# EAGLE schematic pcb (EAGLE 8.1.0)
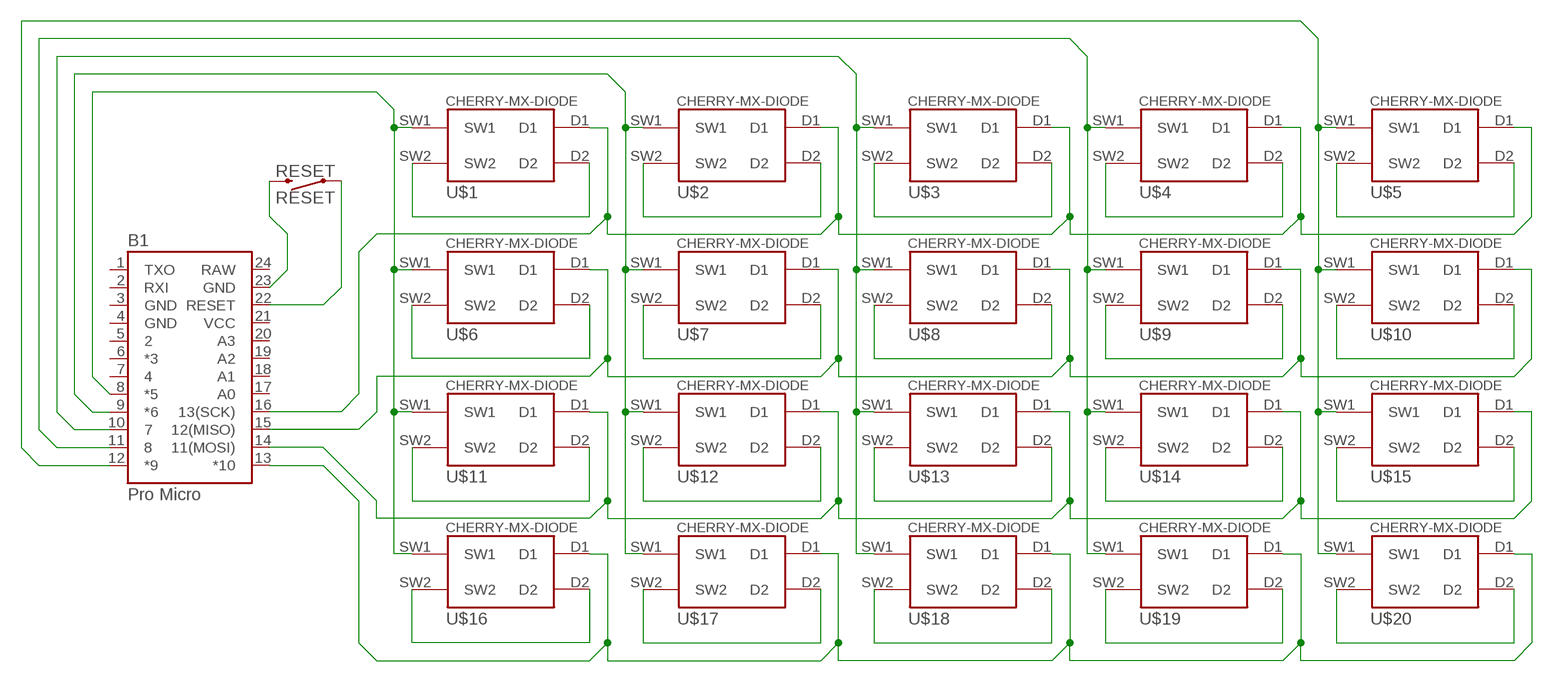
[diagram p0: schematic, sheet 1]

## Parts
B1  Pro Micro  SPARKFUN_PRO_MICRO  [SPARKFUN_PRO_MICRO]
RESET  RESET  MOMENTARY-SWITCH-SPST-PTH-12MM  [TACTILE_SWITCH_PTH_12MM]
U$1  CHERRY-MX-DIODE  [CHERRY-MX-DIODE]
U$2  CHERRY-MX-DIODE  [CHERRY-MX-DIODE]
U$3  CHERRY-MX-DIODE  [CHERRY-MX-DIODE]
U$4  CHERRY-MX-DIODE  [CHERRY-MX-DIODE]
U$5  CHERRY-MX-DIODE  [CHERRY-MX-DIODE]
U$6  CHERRY-MX-DIODE  [CHERRY-MX-DIODE]
U$7  CHERRY-MX-DIODE  [CHERRY-MX-DIODE]
U$8  CHERRY-MX-DIODE  [CHERRY-MX-DIODE]
U$9  CHERRY-MX-DIODE  [CHERRY-MX-DIODE]
U$10  CHERRY-MX-DIODE  [CHERRY-MX-DIODE]
U$11  CHERRY-MX-DIODE  [CHERRY-MX-DIODE]
U$12  CHERRY-MX-DIODE  [CHERRY-MX-DIODE]
U$13  CHERRY-MX-DIODE  [CHERRY-MX-DIODE]
U$14  CHERRY-MX-DIODE  [CHERRY-MX-DIODE]
U$15  CHERRY-MX-DIODE  [CHERRY-MX-DIODE]
U$16  CHERRY-MX-DIODE  [CHERRY-MX-DIODE]
U$17  CHERRY-MX-DIODE  [CHERRY-MX-DIODE]
U$18  CHERRY-MX-DIODE  [CHERRY-MX-DIODE]
U$19  CHERRY-MX-DIODE  [CHERRY-MX-DIODE]
U$20  CHERRY-MX-DIODE  [CHERRY-MX-DIODE]

## Nets
N$1: B1.8(*5) U$1.SW1 U$6.SW1 U$11.SW1 U$16.SW1
N$2: B1.9(*6) U$2.SW1 U$7.SW1 U$12.SW1 U$17.SW1
N$3: B1.23(GND) RESET.3
N$4: B1.11 U$4.SW1 U$9.SW1 U$14.SW1 U$19.SW1
N$5: B1.12(*9) U$5.SW1 U$10.SW1 U$15.SW1 U$20.SW1
N$6: U$2.D2 U$2.SW2
N$7: U$7.D2 U$7.SW2
N$8: U$12.D2 U$12.SW2
N$9: U$17.D2 U$17.SW2
N$10: U$1.D2 U$1.SW2
N$11: U$6.D2 U$6.SW2
N$12: U$11.D2 U$11.SW2
N$13: U$16.D2 U$16.SW2
N$14: U$3.D2 U$3.SW2
N$15: U$8.D2 U$8.SW2
N$16: U$13.D2 U$13.SW2
N$17: U$18.D2 U$18.SW2
N$18: U$4.D2 U$4.SW2
N$19: U$9.D2 U$9.SW2
N$20: U$14.D2 U$14.SW2
N$21: U$19.D2 U$19.SW2
N$22: U$5.D2 U$5.SW2
N$23: U$10.D2 U$10.SW2
N$24: U$15.D2 U$15.SW2
N$25: U$20.D2 U$20.SW2
N$26: B1.22(RESET) RESET.1
N$27: B1.16(13(SCK)) U$1.D1 U$2.D1 U$3.D1 U$4.D1 U$5.D1
N$29: B1.10 U$3.SW1 U$8.SW1 U$13.SW1 U$18.SW1
N$30: B1.13(*10) U$16.D1 U$17.D1 U$18.D1 U$19.D1 U$20.D1
N$31: B1.15(12(MISO)) U$6.D1 U$7.D1 U$8.D1 U$9.D1 U$10.D1
N$32: B1.14(11(MOSI)) U$11.D1 U$12.D1 U$13.D1 U$14.D1 U$15.D1
Unconnected: B1.1(TXO) B1.2(RXI) B1.5 B1.6(*3) B1.7 B1.17(A0) B1.18(A1) B1.19(A2) B1.20(A3)

## Power pins joined to a net without a drawn wire
GND: B1.3(GND) B1.4(GND)
RAW: B1.24(RAW)
VCC: B1.21(VCC)

## Library data of the parts
B1 = SparkFun-Boards:SPARKFUN_PRO_MICRO: SparkFun Pro Micro Atmega32U4 compatible footprint. SparkFun Products: 3.3V/8MHz <https://www.sparkfun.com/products/12587> 5V/16MHz <https://www.sparkfun.com/products/12640>
RESET = SparkFun-Switches:MOMENTARY-SWITCH-SPST: Momentary Switch (Pushbutton) - SPST Normally-open (NO) SPST momentary switches (buttons, pushbuttons). Variants PTH-12MM - 12mm square, through-hole Momentary Pushbutton Switch - 12mm Square <https://www.sparkfun.com/products/9190> (COM-09190) PTH-6.0MM, PTH-6.0MM-KIT - 6.0mm square, through-hole Mini Pushbutton Switch <https://www.sparkfun.com/products/97> (COM-00097) KIT package intended for soldering kit's - only one side of pads' copper is exposed. PTH-RIGHT-ANGLE-KIT - Right-angle, through-hole Right Angle Tactile Button <https://www.sparkfun.com/products/10791> - Used on SparkFun BigTime Watch Kit <https://www.sparkfun.com/products/11734> SMD-12MM - 12mm square, surface-mount Tactile Button - SMD (12mm) <https://www.sparkfun.com/products/12993> (COM-12993) Used on SparkFun PicoBoard <https://www.sparkfun.com/products/11888> SMD-4.5MM - 4.5mm Square Trackball Switch Used on SparkFun Blackberry Trackballer Breakout <https://www.sparkfun.com/products/13169> SMD-4.6MMX2.8MM - 4.60mm x 2.80mm, surface mount Used on SparkFun SAMD21 Mini Breakout <https://www.sparkfun.com/products/13664> SMD-5.2MM, SMD-5.2-REDUNDANT - 5.2mm square, surface-mount Mini Pushbutton Switch - SMD <https://www.sparkfun.com/products/8720> (COM-08720) Used on Arduino Pro Mini <https://www.sparkfun.com/products/11114> REDUNDANT package connects both switch circuits together SMD-6.0X3.5MM - 6.0 x 3.5mm, surface mount Momentary Reset Switch SMD <https://www.sparkfun.com/products/8229> (COM-08229) SMD-6.2MM-TALL - 6.2mm square, surface mount Tactile Button - SMD (6mm) <https://www.sparkfun.com/products/12992> Used on SparkFun Digital Sandbox <https://www.sparkfun.com/products/12651> SMD-RIGHT-ANGLE - Right-angle, surface mount Used on SparkFun Block for Intel® Edison - Arduino <https://www.sparkfun.com/products/13036>; PROD_ID: SWCH-09185; SF_SKU: COM-09190
U$1-U$20 = cherrymx:CHERRY-MX-DIODE: Cherry MX series keyswitch with diode bridge